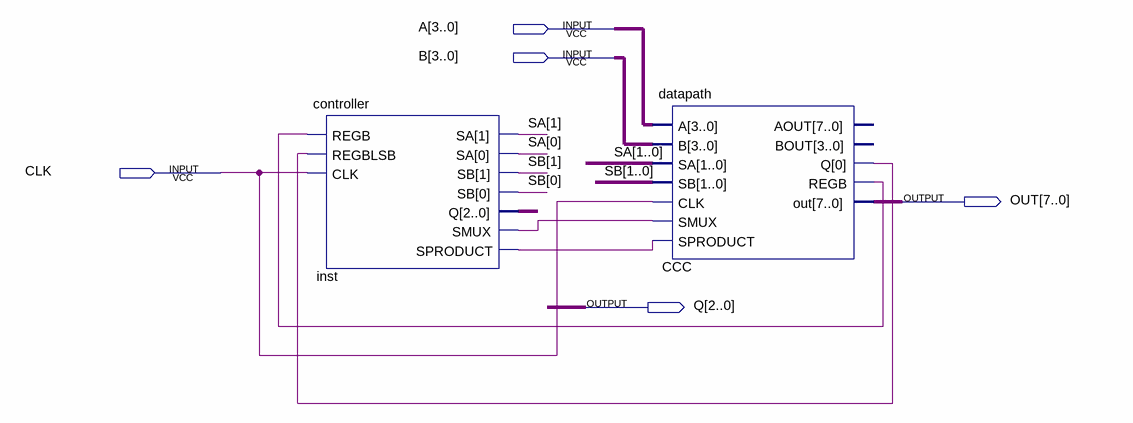
[diagram p0: schematic sheet]
// Quartus schematic FULL_DATAPATH_CONTROLER.bdf as structural Verilog: 2 symbols, 5 pins
module FULL_DATAPATH_CONTROLER (
  input  [3:0] A,
  input  [3:0] B,
  input  CLK,
  output [7:0] OUT,
  output [2:0] Q
);

  wire CCC_q, CCC_regb, inst_smux, inst_sproduct;
  wire [1:0] SA, SB;
  wire [2:0] inst_q;

  controller inst (
    .REGB(CCC_regb), .REGBLSB(CCC_q), .CLK(CLK), .SA(SA), .SB(SB), .Q(inst_q), .SMUX(inst_smux),
    .SPRODUCT(inst_sproduct));
  datapath CCC (
    .A(A), .B(B), .SA(SA), .SB(SB), .CLK(CLK), .SMUX(inst_smux), .SPRODUCT(inst_sproduct), .Q(CCC_q),
    .REGB(CCC_regb), .out(OUT));  // open: AOUT, BOUT
endmodule
